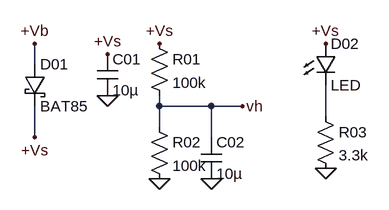
[diagram p0: schematic Channel Two power circuit.asc]
Channel Two power circuit.asc, the LTspice schematic file:
Version 4
SHEET 1 1044 1156
WIRE -800 432 -800 400
WIRE -608 496 -608 480
WIRE -528 496 -608 496
WIRE -480 496 -528 496
WIRE -352 512 -352 464
WIRE -608 528 -608 496
WIRE -800 544 -800 496
WIRE -528 544 -528 496
FLAG -608 608 0
FLAG -608 400 +Vs
FLAG -480 496 vh
FLAG -528 608 0
FLAG -800 400 +Vb
FLAG -800 544 +Vs
FLAG -352 400 +Vs
FLAG -352 592 0
FLAG -688 480 0
FLAG -688 416 +Vs
SYMBOL res -624 384 R0
SYMATTR InstName R01
SYMATTR Value 100k
SYMBOL res -624 512 R0
SYMATTR InstName R02
SYMATTR Value 100k
SYMBOL cap -544 544 R0
SYMATTR InstName C02
SYMATTR Value 10µ
SYMBOL schottky -816 432 R0
SYMATTR InstName D01
SYMATTR Value BAT85
SYMBOL LED -368 400 R0
SYMATTR InstName D02
SYMATTR Value LED
SYMBOL res -368 496 R0
SYMATTR InstName R03
SYMATTR Value 3.3k
SYMBOL cap -704 416 R0
SYMATTR InstName C01
SYMATTR Value 10µ

The netlist it stands for:
* Channel Two power circuit.asc
R01 +Vs vh 100k
R02 vh 0 100k
C02 vh 0 10µ
D01 +Vb +Vs BAT85
D02 +Vs N001 LED
R03 N001 0 3.3k
C01 +Vs 0 10µ
.model D D
.lib standard.dio
.backanno
.end